# EAGLE design BLDC_Motor_Controller_2016_Rev1 (EAGLE 7.3.0)
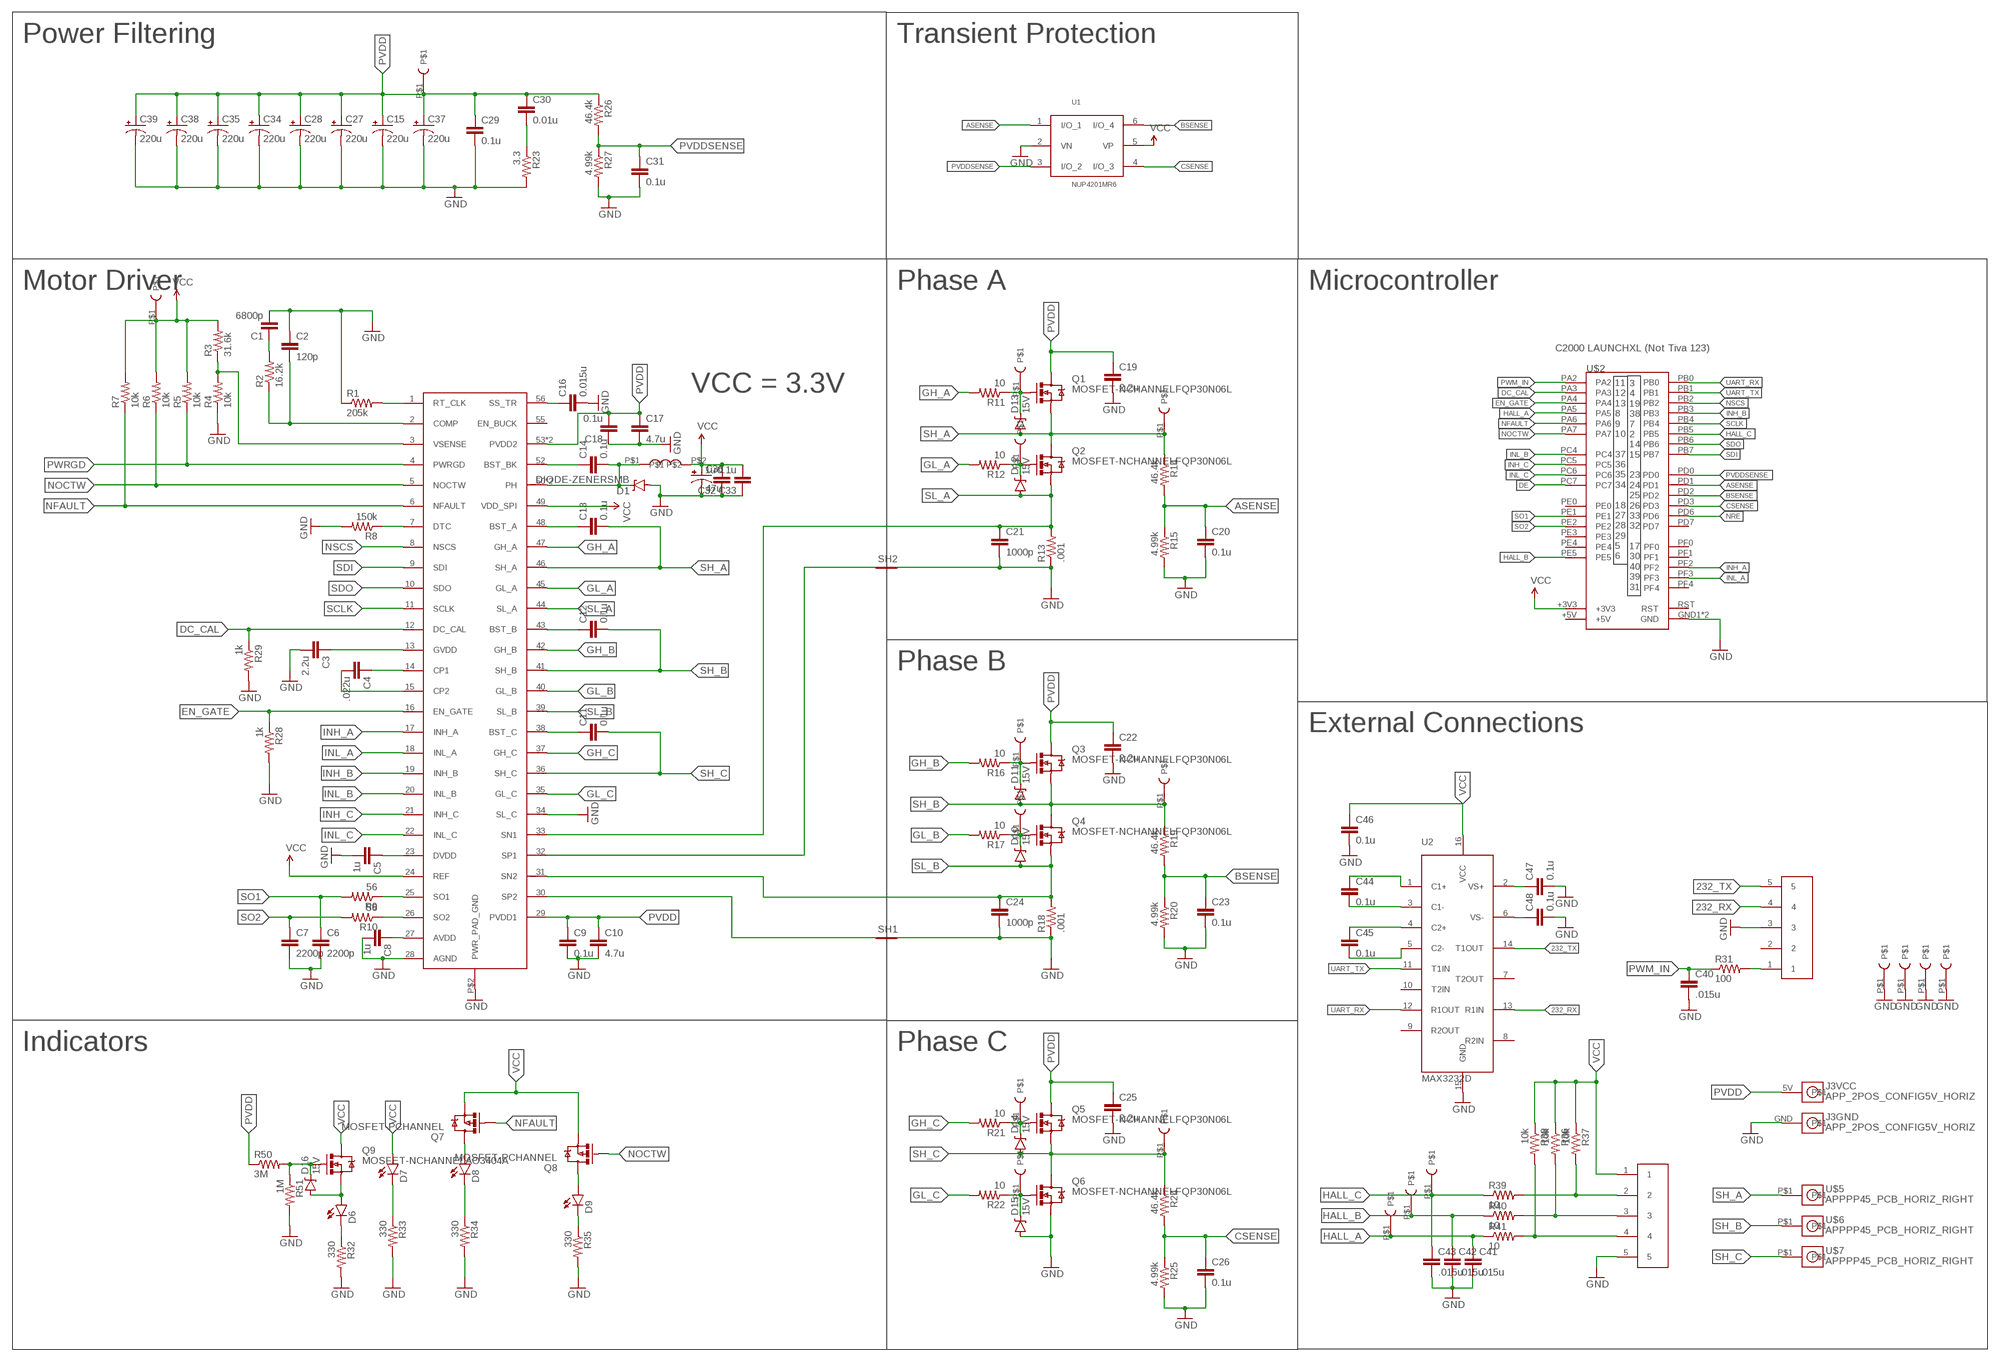
[diagram p0: schematic, sheet 1]

## Parts
C1  6800p  CAP0805  [0805]
C2  120p  CAP0805  [0805]
C3  2.2u  CAP1206  [1206]
C4  .022u  CAP0805  [0805]
C5  1u  CAP0805  [0805]
C6  2200p  CAP0805  [0805]
C7  2200p  CAP0805  [0805]
C8  1u  CAP0805  [0805]
C9  0.1u  CAP0805  [0805]
C10  4.7u  CAP1206  [1206]
C11  0.1u  CAP0805  [0805]
C12  0.1u  CAP0805  [0805]
C13  0.1u  CAP0805  [0805]
C14  0.1u  CAP0805  [0805]
C15  220u  CAP_POLPTH4  [CPOL-RADIAL-1000UF-25V]
C16  0.015u  CAP0805  [0805]
C17  4.7u  CAP1206  [1206]
C18  0.1u  CAP0805  [0805]
C19  2.2u  CAP1206  [1206]
C20  0.1u  CAP0805  [0805]
C21  1000p  CAP0805  [0805]
C22  2.2u  CAP1206  [1206]
C23  0.1u  CAP0805  [0805]
C24  1000p  CAP0805  [0805]
C25  2.2u  CAP1206  [1206]
C26  0.1u  CAP0805  [0805]
C27  220u  CAP_POLPTH4  [CPOL-RADIAL-1000UF-25V]
C28  220u  CAP_POLPTH4  [CPOL-RADIAL-1000UF-25V]
C29  0.1u  CAP0805  [0805]
C30  0.01u  CAP0805  [0805]
C31  0.1u  CAP0805  [0805]
C32  1u  CAP0805  [0805]
C33  0.1u  CAP0805  [0805]
C34  220u  CAP_POLPTH4  [CPOL-RADIAL-1000UF-25V]
C35  220u  CAP_POLPTH4  [CPOL-RADIAL-1000UF-25V]
C36  47u  CAP_POLPTH1  [CPOL-RADIAL-100UF-25V]
C37  220u  CAP_POLPTH4  [CPOL-RADIAL-1000UF-25V]
C38  220u  CAP_POLPTH4  [CPOL-RADIAL-1000UF-25V]
C39  220u  CAP_POLPTH4  [CPOL-RADIAL-1000UF-25V]
C40  .015u  CAP0805  [0805]
C41  .015u  CAP0805  [0805]
C42  .015u  CAP0805  [0805]
C43  .015u  CAP0805  [0805]
C44  0.1u  CAP0805  [0805]
C45  0.1u  CAP0805  [0805]
C46  0.1u  CAP0805  [0805]
C47  0.1u  CAP0805  [0805]
C48  0.1u  CAP0805  [0805]
D1  DIODE-ZENERSMB  [SMB-DIODE]
D6  LED1206  [LED-1206]
D7  LED1206  [LED-1206]
D8  LED1206  [LED-1206]
D9  LED1206  [LED-1206]
D10  15V  DIODE-ZENER3.3V  [SOD-323]
D11  15V  DIODE-ZENER3.3V  [SOD-323]
D12  15V  DIODE-ZENER3.3V  [SOD-323]
D13  15V  DIODE-ZENER3.3V  [SOD-323]
D14  15V  DIODE-ZENER3.3V  [SOD-323]
D15  15V  DIODE-ZENER3.3V  [SOD-323]
D16  15V  DIODE-ZENER3.3V  [SOD-323]
J3  APP_2POS_CONFIG5V_HORIZ  [APP45_5V_HORIZ_CONFIG]
Q1  MOSFET-NCHANNELFQP30N06L  [TO220V]
Q2  MOSFET-NCHANNELFQP30N06L  [TO220V]
Q3  MOSFET-NCHANNELFQP30N06L  [TO220V]
Q4  MOSFET-NCHANNELFQP30N06L  [TO220V]
Q5  MOSFET-NCHANNELFQP30N06L  [TO220V]
Q6  MOSFET-NCHANNELFQP30N06L  [TO220V]
Q7  MOSFET-PCHANNEL  [SOT23-3]
Q8  MOSFET-PCHANNEL  [SOT23-3]
Q9  MOSFET-NCHANNELAO3404A  [SOT23-3]
R1  205k  RESISTOR0805-RES  [0805]
R2  16.2k  RESISTOR0805-RES  [0805]
R3  31.6k  RESISTOR0805-RES  [0805]
R4  10k  RESISTOR0805-RES  [0805]
R5  10k  RESISTOR0805-RES  [0805]
R6  10k  RESISTOR0805-RES  [0805]
R7  10k  RESISTOR0805-RES  [0805]
R8  150k  RESISTOR0805-RES  [0805]
R9  56  RESISTOR0805-RES  [0805]
R10  56  RESISTOR0805-RES  [0805]
R11  10  RESISTOR0805-RES  [0805]
R12  10  RESISTOR0805-RES  [0805]
R13  .001  RESISTOR1206  [1206]
R14  46.4k  RESISTOR0805-RES  [0805]
R15  4.99k  RESISTOR0805-RES  [0805]
R16  10  RESISTOR0805-RES  [0805]
R17  10  RESISTOR0805-RES  [0805]
R18  .001  RESISTOR1206  [1206]
R19  46.4k  RESISTOR0805-RES  [0805]
R20  4.99k  RESISTOR0805-RES  [0805]
R21  10  RESISTOR0805-RES  [0805]
R22  10  RESISTOR0805-RES  [0805]
R23  3.3  RESISTOR0805-RES  [0805]
R24  46.4k  RESISTOR0805-RES  [0805]
R25  4.99k  RESISTOR0805-RES  [0805]
R26  46.4k  RESISTOR0805-RES  [0805]
R27  4.99k  RESISTOR0805-RES  [0805]
R28  1k  RESISTOR0805-RES  [0805]
R29  1k  RESISTOR0805-RES  [0805]
R31  100  RESISTOR0805-RES  [0805]
R32  330  RESISTOR0805-RES  [0805]
R33  330  RESISTOR0805-RES  [0805]
R34  330  RESISTOR0805-RES  [0805]
R35  330  RESISTOR0805-RES  [0805]
R36  10k  RESISTOR0805-RES  [0805]
R37  10k  RESISTOR0805-RES  [0805]
R38  10k  RESISTOR0805-RES  [0805]
R39  10  RESISTOR0805-RES  [0805]
R40  10  RESISTOR0805-RES  [0805]
R41  10  RESISTOR0805-RES  [0805]
R50  3M  RESISTOR0805-RES  [0805]
R51  1M  RESISTOR0805-RES  [0805]
SH1  SHORT-HT5  [SHORT_TOP-50]
SH2  SHORT-HT5  [SHORT_TOP-50]
U1  NUP4201MR6  [TSOP-6]
U2  MAX3232D  [SOIC16]
U$1  DRV8301  [DCA]
U$2  TIVA-C  [TIVA-C]
U$4  5PIN  [5PIN]
U$5  APPPP45_PCB_HORIZ_RIGHT  [APP45_PCB_HORIZ_RIGHT]
U$6  APPPP45_PCB_HORIZ_RIGHT  [APP45_PCB_HORIZ_RIGHT]
U$7  APPPP45_PCB_HORIZ_RIGHT  [APP45_PCB_HORIZ_RIGHT]
U$8  5PIN  [5PIN]
U$10  TEST_POINT_0.1INDIAM  [TEST_POINT_0.1INDIAM]
U$11  TEST_POINT_0.1INDIAM  [TEST_POINT_0.1INDIAM]
U$12  TEST_POINT_0.1INDIAM  [TEST_POINT_0.1INDIAM]
U$14  33u  INDUCTOR_DR74  [INDUCTOR_DR74]
U$15  TEST_POINT_0.1INDIAM  [TEST_POINT_0.1INDIAM]
U$16  TEST_POINT_0.1INDIAM  [TEST_POINT_0.1INDIAM]
U$17  TEST_POINT_0.1INDIAM  [TEST_POINT_0.1INDIAM]
U$18  TEST_POINT_0.1INDIAM  [TEST_POINT_0.1INDIAM]
U$19  TEST_POINT_0.1INDIAM  [TEST_POINT_0.1INDIAM]
U$20  TEST_POINT_0.1INDIAM  [TEST_POINT_0.1INDIAM]
U$21  TEST_POINT_0.1INDIAM  [TEST_POINT_0.1INDIAM]
U$22  TEST_POINT_0.1INDIAM  [TEST_POINT_0.1INDIAM]
U$23  TEST_POINT_0.1INDIAM  [TEST_POINT_0.1INDIAM]
U$24  TEST_POINT_0.1INDIAM  [TEST_POINT_0.1INDIAM]
U$25  TEST_POINT_0.1INDIAM  [TEST_POINT_0.1INDIAM]
U$26  TEST_POINT_0.1INDIAM  [TEST_POINT_0.1INDIAM]
U$27  TEST_POINT_0.1INDIAM  [TEST_POINT_0.1INDIAM]
U$28  TEST_POINT_0.1INDIAM  [TEST_POINT_0.1INDIAM]
U$29  TEST_POINT_0.1INDIAM  [TEST_POINT_0.1INDIAM]

## Nets
232_RX: U2.13(R1IN) U$4.4
232_TX: U2.14(T1OUT) U$4.5
ASENSE: C20.1 R14.2 R15.1 U1.1(I/O_1) U$2.PD1
BSENSE: C23.1 R19.2 R20.1 U1.6(I/O_4) U$2.PD2
CSENSE: C26.1 R24.2 R25.1 U1.4(I/O_3) U$2.PD3
DC_CAL: R29.1 U$1.12(DC_CAL) U$2.PA3
DE: U$2.PC7
EN_GATE: R28.1 U$1.16(EN_GATE) U$2.PA4
GH_A: R11.2 U$1.47(GH_A)
GH_B: R16.2 U$1.42(GH_B)
GH_C: R21.2 U$1.37(GH_C)
GL_A: R12.2 U$1.45(GL_A)
GL_B: R17.2 U$1.40(GL_B)
GL_C: R22.2 U$1.35(GL_C)
GND: C1.2 C2.1 C3.2 C5.2 C6.2 C7.2 C8.2 C9.2 C10.2 C15.2(-) C16.2 C17.2 C18.1 C19.2 C20.2 C21.2 C22.2 C23.2 C24.2 C25.2 C26.2 C27.2(-) C28.2(-) C29.2 C31.2 C32.1 C33.1 C34.2(-) C35.2(-) C36.2(-) C37.2(-) C38.2(-) C39.2(-) C40.2 C41.2 C42.2 C43.2 C46.2 C47.2 C48.2 D1.A D15.A J3.GND Q6.3(S) R1.1 R4.1 R8.2 R13.1 R15.2 R18.1 R20.2 R23.2 R25.2 R27.2 R28.2 R29.2 R32.2 R33.2 R34.2 R35.2 R51.2 SH1.2 SH2.2 U1.2(VN) U2.15(GND) U$1.28(AGND) U$1.34(SL_C) U$1.P$2(PWR_PAD_GND) U$2.GND1(GND) U$2.GND2(GND) U$4.3 U$8.5 U$26.P$1 U$27.P$1 U$28.P$1 U$29.P$1
HALL_A: C41.1 R41.1 U$2.PA5 U$22.P$1
HALL_B: C42.1 R40.1 U$2.PE5 U$21.P$1
HALL_C: C43.1 R39.1 U$2.PB5 U$23.P$1
INH_A: U$1.17(INH_A) U$2.PF2
INH_B: U$1.19(INH_B) U$2.PB3
INH_C: U$1.21(INH_C) U$2.PC5
INL_A: U$1.18(INL_A) U$2.PF3
INL_B: U$1.20(INL_B) U$2.PC4
INL_C: U$1.22(INL_C) U$2.PC6
N$1: C2.2 R2.1 U$1.2(COMP)
N$2: C1.1 R2.2
N$3: R3.1 R4.2 U$1.3(VSENSE)
N$4: R1.2 U$1.1(RT_CLK)
N$5: R8.1 U$1.7(DTC)
N$6: C4.1 U$1.14(CP1)
N$7: C4.2 U$1.15(CP2)
N$8: C3.1 U$1.13(GVDD)
N$9: C5.1 U$1.23(DVDD)
N$10: R9.1 U$1.25(SO1)
N$11: R10.1 U$1.26(SO2)
N$12: C8.1 U$1.27(AVDD)
N$13: D13.C Q1.1(G) R11.1 U$12.P$1
N$14: D11.C Q3.1(G) R16.1 U$16.P$1
N$15: D10.C Q4.1(G) R17.1 U$17.P$1
N$16: D12.C Q2.1(G) R12.1 U$15.P$1
N$17: D14.C Q5.1(G) R21.1 U$18.P$1
N$18: D15.C Q6.1(G) R22.1 U$19.P$1
N$20: R37.2 R39.2 U$8.2
N$21: C11.1 U$1.38(BST_C)
N$22: C30.2 R23.1
N$23: D6.C R32.1
N$24: D7.C R33.1
N$25: C12.1 U$1.43(BST_B)
N$26: D8.C R34.1
N$27: D9.C R35.1
N$28: D9.A Q8.3(D)
N$29: C13.1 U$1.48(BST_A)
N$30: C14.1 U$1.52(BST_BK)
N$31: C14.2 D1.C U$1.50(PH) U$1.51(PH) U$14.P$1
N$32: D8.A Q7.3(D)
N$33: R36.2 R40.2 U$8.3
N$34: R31.2 U$4.1
N$35: C16.1 U$1.56(SS_TR)
N$38: D16.C Q9.1(G) R50.2 R51.1
N$39: R38.2 R41.2 U$8.4
N$40: C44.1 U2.1(C1+)
N$41: D6.A D16.A Q9.2(S)
N$42: C44.2 U2.3(C1-)
N$43: C45.1 U2.4(C2+)
N$44: C45.2 U2.5(C2-)
N$45: C48.1 U2.6(VS-)
N$46: C47.1 U2.2(VS+)
NFAULT: Q7.1(G) R7.1 U$1.6(NFAULT) U$2.PA6
NOCTW: Q8.1(G) R6.1 U$1.5(NOCTW) U$2.PA7
NRE: U$2.PD6
NSCS: U$1.8(NSCS) U$2.PB2
PVDD: C9.1 C10.1 C15.1(+) C17.1 C18.2 C19.1 C22.1 C25.1 C27.1(+) C28.1(+) C29.1 C30.1 C34.1(+) C35.1(+) C37.1(+) C38.1(+) C39.1(+) J3.5V Q1.2(D) Q3.2(D) Q5.2(D) R26.1 R50.1 U$1.29(PVDD1) U$1.53(PVDD2) U$1.54(PVDD2) U$11.P$1
PVDDSENSE: C31.1 R26.2 R27.1 U1.3(I/O_2) U$2.PD0
PWM_IN: C40.1 R31.1 U$2.PA2
PWRGD: R5.1 U$1.4(PWRGD)
SCLK: U$1.11(SCLK) U$2.PB4
SDI: U$1.9(SDI) U$2.PB7
SDO: U$1.10(SDO) U$2.PB6
SH_A: C13.2 D13.A Q1.3(S) Q2.2(D) R14.1 U$1.46(SH_A) U$5.P$1 U$25.P$1
SH_B: C12.2 D11.A Q3.3(S) Q4.2(D) R19.1 U$1.41(SH_B) U$6.P$1 U$24.P$1
SH_C: C11.2 D14.A Q5.3(S) Q6.2(D) R24.1 U$1.36(SH_C) U$7.P$1 U$20.P$1
SL_A: C21.1 D12.A Q2.3(S) R13.2 U$1.33(SN1) U$1.44(SL_A)
SL_B: C24.1 D10.A Q4.3(S) R18.2 U$1.31(SN2) U$1.39(SL_B)
SO1: C6.1 R9.2 U$2.PE1
SO2: C7.1 R10.2 U$2.PE2
SP1: SH2.1 U$1.32(SP1)
SP2: SH1.1 U$1.30(SP2)
UART_RX: U2.12(R1OUT) U$2.PB0
UART_TX: U2.11(T1IN) U$2.PB1
VCC: C32.2 C33.2 C36.1(+) C46.1 D7.A Q7.2(S) Q8.2(S) Q9.3(D) R3.2 R5.2 R6.2 R7.2 R36.1 R37.1 R38.1 U1.5(VP) U2.16(VCC) U$1.24(REF) U$1.49(VDD_SPI) U$2.+3V3 U$8.1 U$10.P$1 U$14.P$2
Unconnected: U2.7(T2OUT) U2.8(R2IN) U2.9(R2OUT) U2.10(T2IN) U$1.55(EN_BUCK) U$2.PD7 U$2.PE0 U$2.PE3 U$2.PE4 U$2.PF0 U$2.PF1 U$2.PF4 U$4.2

## Notes on the sheet
- Power Filtering | Transient Protection
- Motor Driver | Phase A | Microcontroller
- C2000 LAUNCHXL (Not Tiva 123)
- VCC = 3.3V
- 11
  12
  13
  8
  9
  10
  
  37
  36
  35
  34
  
  18
  27
  28
  29
  5
  6
- 3
  4
  19
  38
  7
  2
  14
  15
  
  23
  24
  25
  26
  33
  32
  
  17
  30
  40
  39
  31
- Phase B
- External Connections
- Indicators | Phase C

## Power pins joined to a net without a drawn wire
+5V: U$2.+5V
RST: U$2.RST

## Library data of the parts
C1-C14 C16-C26 C29-C33 C40-C48 = SparkFun-Passives:CAP: Capacitor Standard 0603 ceramic capacitor, and 0.1" leaded capacitor.
C15 C27 C28 C34-C39 = SparkFun-Passives:CAP_POL: Capacitor Polarized These are standard SMD and PTH capacitors. Normally 10uF, 47uF, and 100uF in electrolytic and tantalum varieties. Always verify the external diameter of the through hole cap, it varies with capacity, voltage, and manufacturer. The EIA devices should be standard.
D1 = SparkFun-DiscreteSemi:DIODE-ZENER: Zener Diode Production Part - 8199 3.4V Zener Voltage
D6-D9 = SparkFun-LED:LED: LEDs Standard schematic elements and footprints for 5mm, 3mm, 1206, and 0603 sized LEDs. 5mm - Spark Fun Electronics SKU : COM-00529 (and others)
D10-D16 = SparkFun-DiscreteSemi:DIODE-ZENER: Zener Diode Production Part - 8199 3.4V Zener Voltage; PROD_ID: DIO-11284; VALUE: 3.3V
J3 = MRDT-Connectors:APP_2POS_CONFIG; COLOR1: RED; COLOR2: BLACK
Q1-Q6 = SparkFun-DiscreteSemi:MOSFET-NCHANNEL: Common NMOSFET Parts MFG P/N Store ID Prod ID FDD8780 TRANS-09984 SI7820DN TRANS-11055 FDS6630A IC-08089 2N7002PW TRANS-11151 FQP30N06L COM-10213 TRANS-10060 BSS123LT1G TRANS-08345 BSS138 TRANS-00830 BS170 2N7000; PROD_ID: TRANS-10060
Q7 Q8 = SparkFun-DiscreteSemi:MOSFET-PCHANNEL: Generic PMOSFET IRLML2244 - TRANS-11153 (SOT-23 -20V -4.3A) (1.Gate 2.Source 3.Drain) FQP27P06 - COM-10349 <http://www.sparkfun.com/products/10349> (TO-220 -60V -27A) (1.Gate 2.Source 3.Drain); PROD_ID: TRANS-08285
Q9 = SparkFun-DiscreteSemi:MOSFET-NCHANNEL: Common NMOSFET Parts MFG P/N Store ID Prod ID FDD8780 TRANS-09984 SI7820DN TRANS-11055 FDS6630A IC-08089 2N7002PW TRANS-11151 FQP30N06L COM-10213 TRANS-10060 BSS123LT1G TRANS-08345 BSS138 TRANS-00830 BS170 2N7000; PROD_ID: TRAN-12988
R1-R29 R31-R41 R50 R51 = SparkFun-Passives:RESISTOR: Resistor Basic schematic elements and footprints for 0603, 1206, and PTH resistors.
SH1 SH2 = BLDC_Motor_Controller_2016_Rev1:SHORT-H: Short between two nets; BOM: no
U1 = MRDT-ICs:NUP4201MR6
U2 = MRDT-ICs:MAX*232; OPERATING_VOLTAGE: 3V3
U$1 = DRV8301:DRV8301
U$2 = MRDT-2015-General:TIVA-C: TIVA-C DEV BOARD (NON-CONNECTED)
U$4 U$8 = Molex-SL:5PIN
U$5-U$7 = MRDT-Connectors:APP: http://www.powerwerx.com/anderson-powerpoles/
U$10-U$12 U$15-U$29 = MRDT-Connectors:TEST_POINT_0.1INDIAM
U$14 = Inductor_DR74:INDUCTOR_DR74

## Board
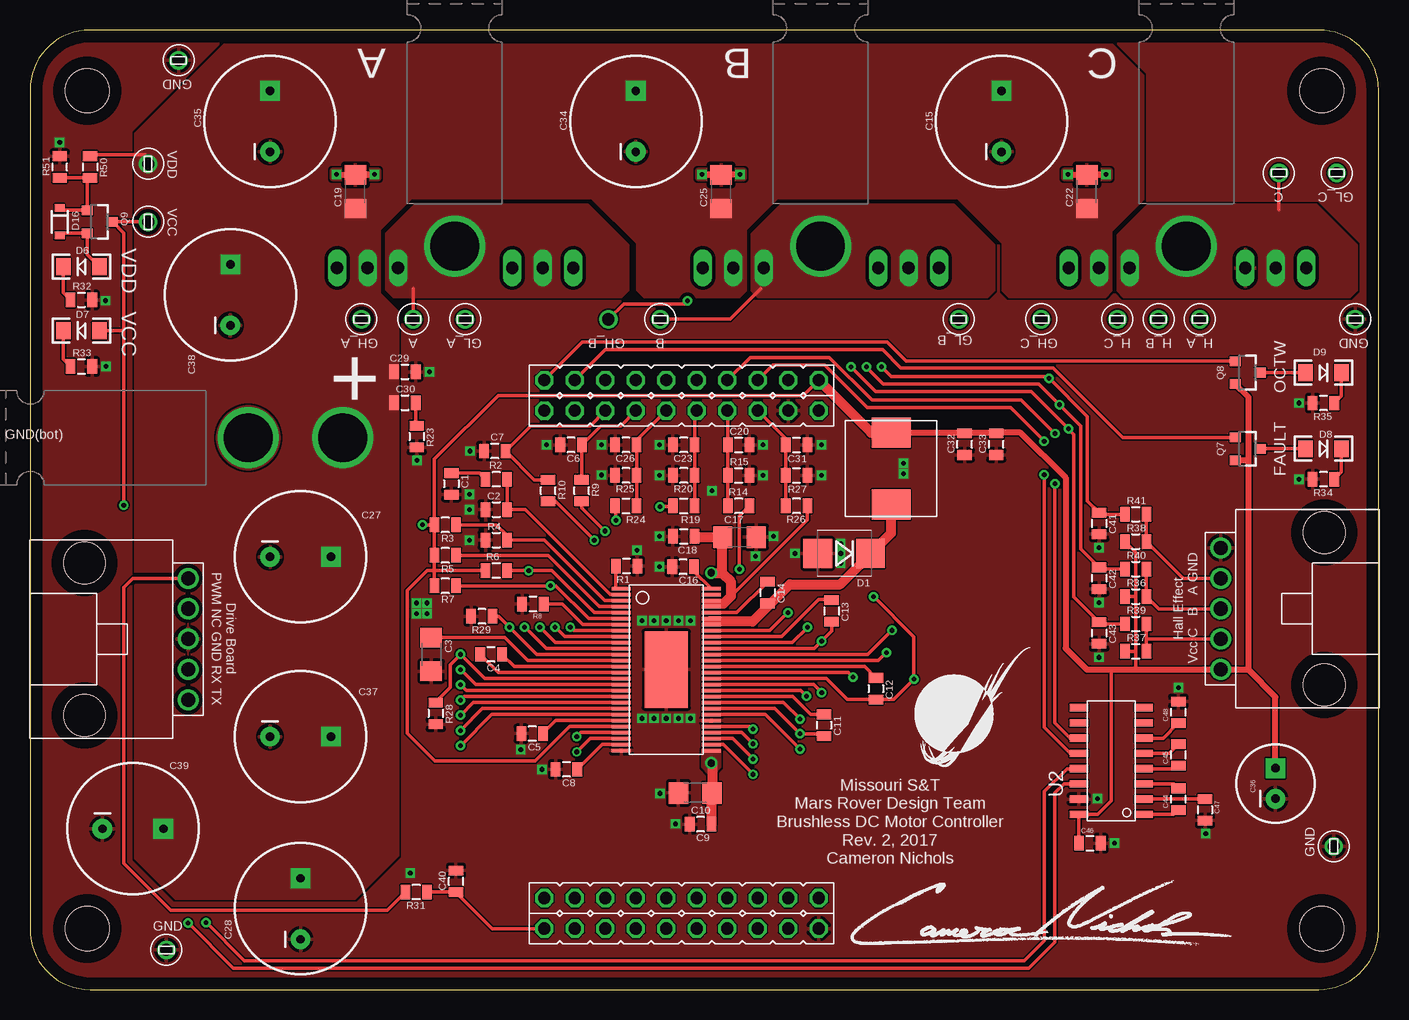
[diagram p1: board, top side]
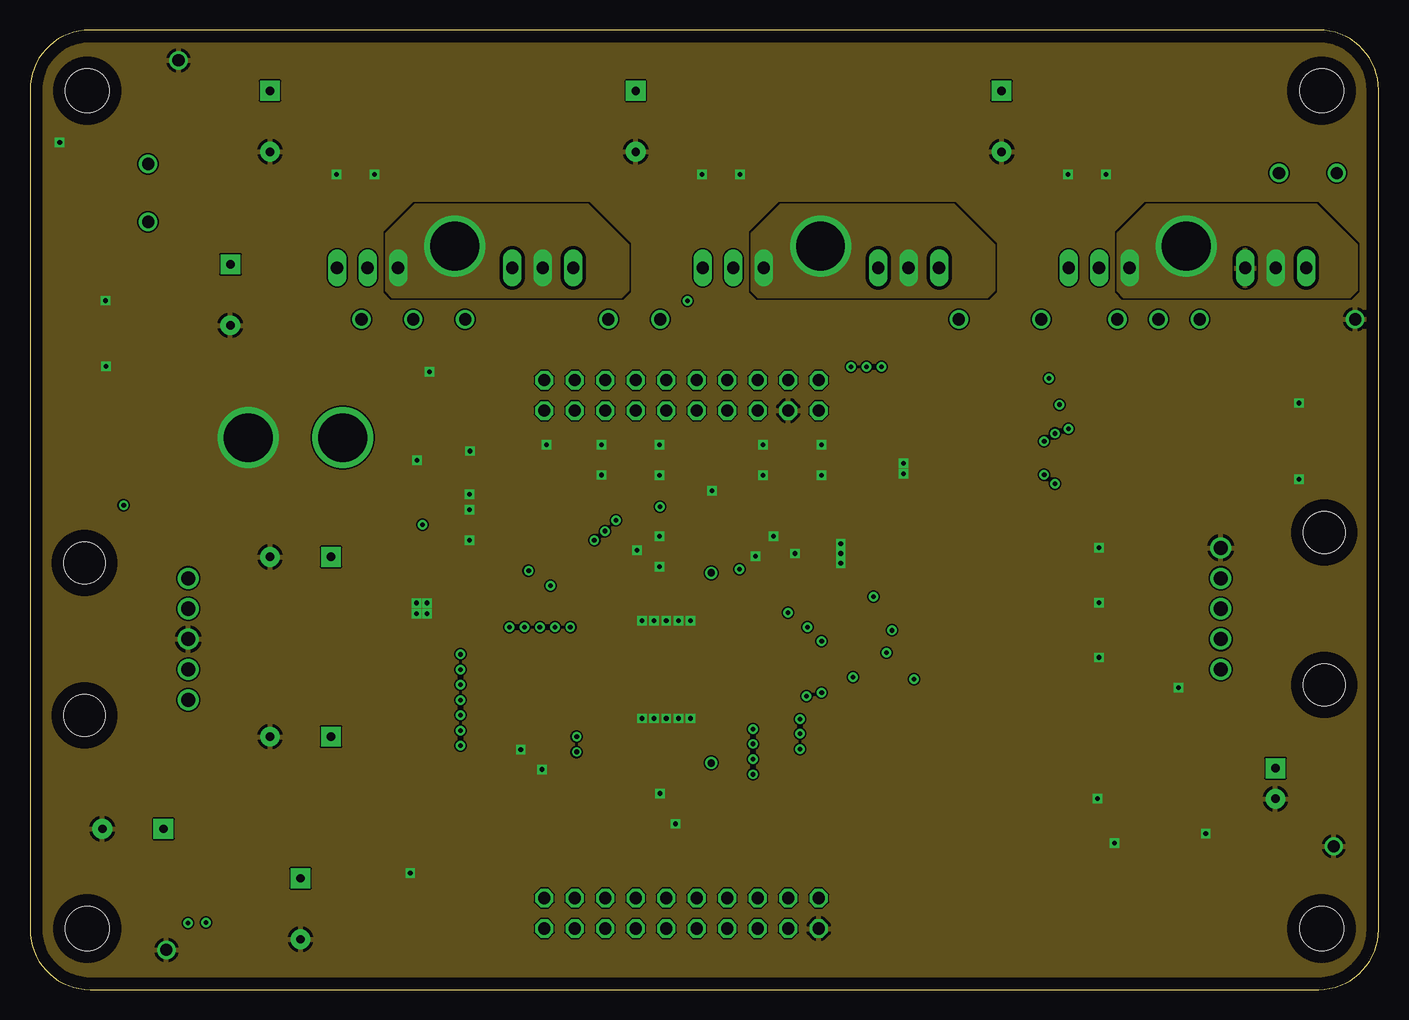
[diagram p2: board, inner layer UpperMid]
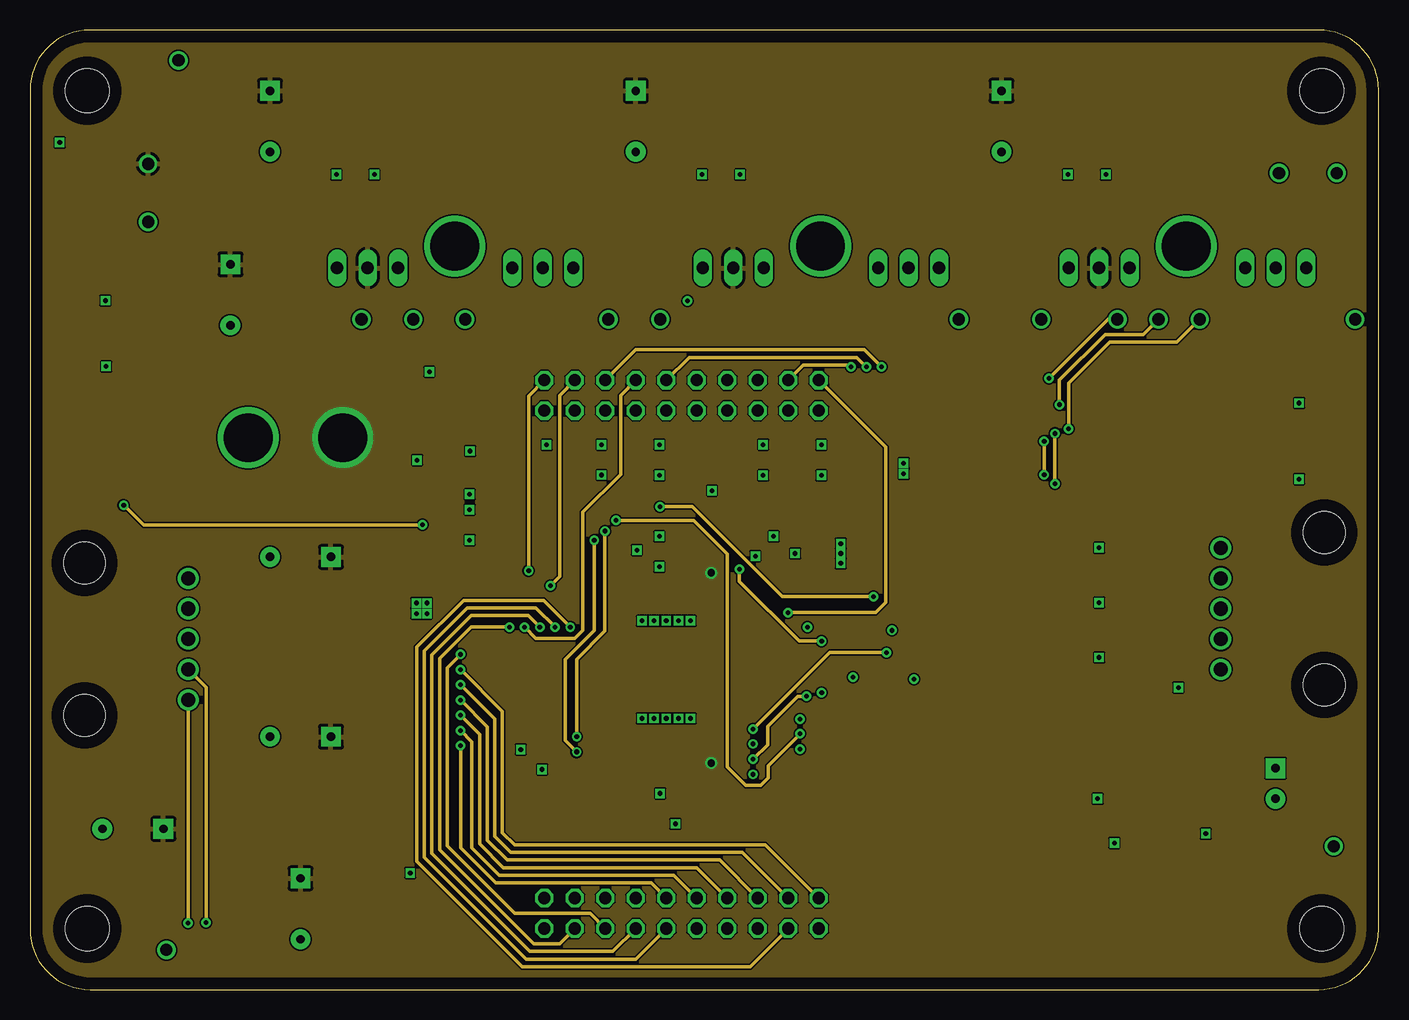
[diagram p3: board, inner layer LowerMid]
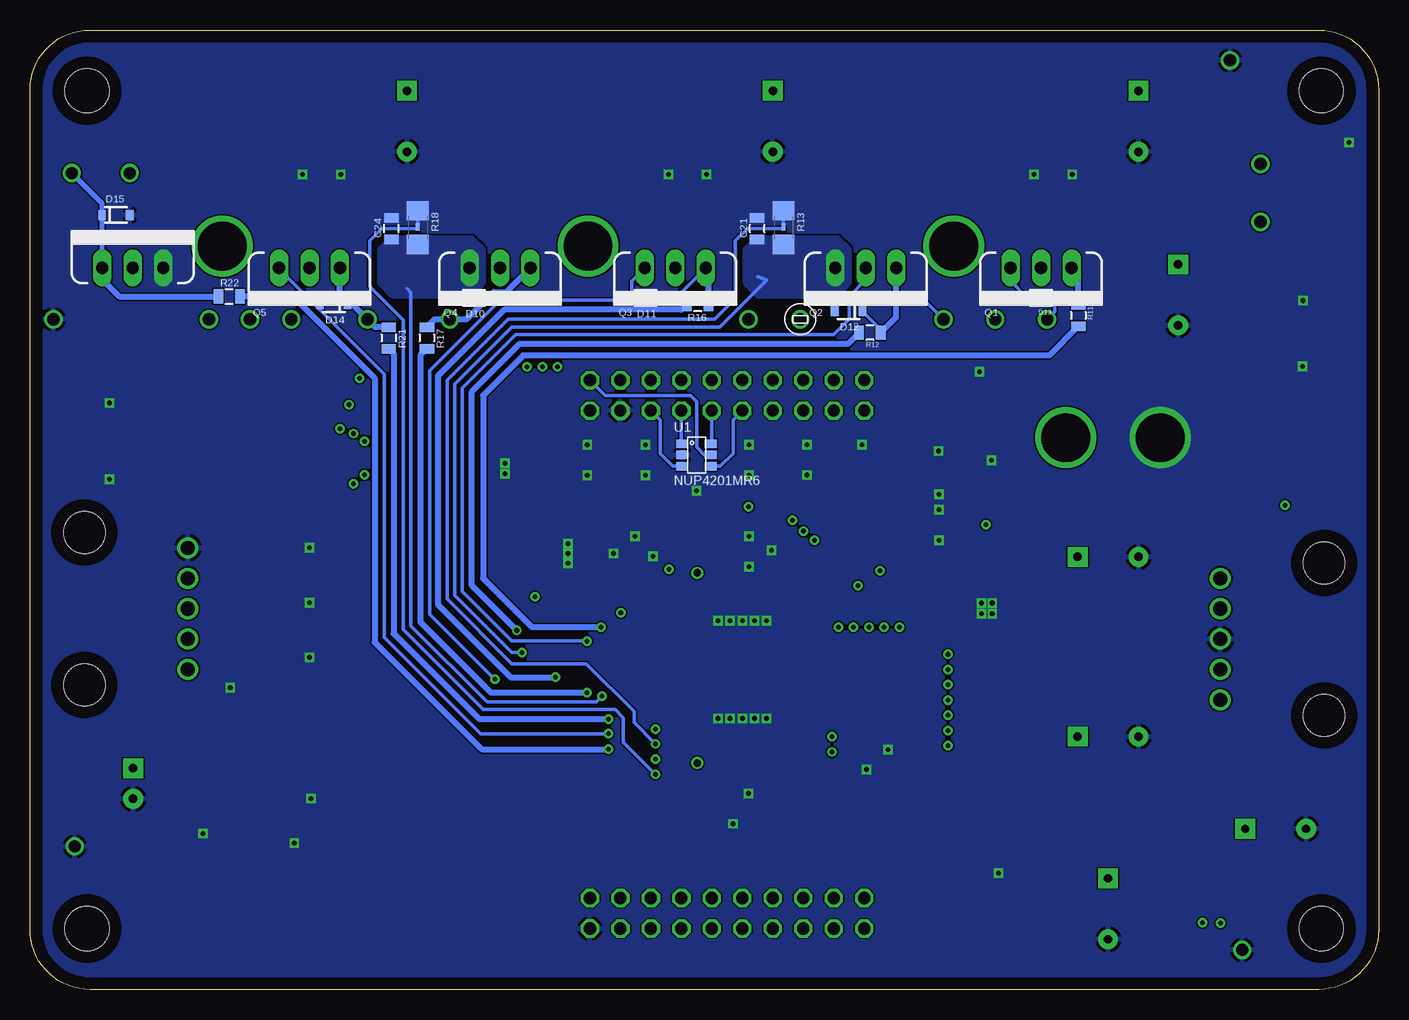
[diagram p4: board, bottom side, seen from below]

Size 112.38 x 80 mm. Coordinates in mm from the lower left corner, seen from the top.
Outline: 5,0 107.38,0 arc90 112.38,5 112.38,75 arc90 107.38,80 5,80 arc90 0,75 0,5 arc90 5,0
Copper layers (1*2*15*16): Top 0.035mm / dielectric 1.5mm / UpperMid 0.035mm / dielectric 0.15mm / LowerMid 0.035mm / dielectric 0.2mm / Bottom 0.035mm
Design rules "advanced_circuits_standard *": minimum track width 5mil, minimum drill 10mil, track to track 5mil, track to pad 5mil, pad to pad 5mil, via to via 5mil, smd to smd 5mil, copper to edge 40mil, drill to drill 5mil, minimum pad ring 10mil, minimum via ring 8mil, stop-mask expansion 4mil, vias tented up to drill 0mil, thermal gap 10mil
Holes 3.66 mm at 4.76,74.93 4.76,5.08 107.63,5.08 107.63,74.93

### Footprints (pad centres in the part's own frame; a part is rotated, then mirrored left to right if it is on the bottom)
0805 = smd 0.8 x 1.2: 1 -0.9,0; 2 0.9,0
1206 = smd 1.6 x 1.8: 1 -1.4,0; 2 1.4,0
CPOL-RADIAL-1000UF-25V = drill 0.7 pad 1.651 square: 1 2.54,0 | drill 0.7 pad 1.651: 2 -2.54,0
CPOL-RADIAL-100UF-25V = drill 0.7 pad 1.651 square: 1 1.27,0 | drill 0.7 pad 1.651: 2 -1.27,0
SMB-DIODE = smd 2.4 x 2.4: A 2.2,0; C -2.2,0
LED-1206 = smd 1.2 x 1.4: A -1.5,0; C 1.5,0
SOD-323 = smd 0.63 x 0.83: A 1.15,0; C -1.15,0
APP45_5V_HORIZ_CONFIG = drill 4.064: 5V 36.068,3.937; GND 28.194,3.937
TO220V = drill 1.016 long: 1 -2.54,0; 2 0,0; 3 2.54,0
SOT23-3 = smd 0.8 x 0.9: 1 -0.95,-1; 2 0.95,-1; 3 0,1.1
SHORT_TOP-50 = smd 0.305 x 0.305: 1 0.152,0; 2 -0.152,0
TSOP-6 = smd 0.991 x 0.711: 1 -1.194,0.94; 2 -1.194,0; 3 -1.194,-0.94; 4 1.194,-0.94; 5 1.194,0; 6 1.194,0.94
SOIC16 = smd 0.6 x 1.55: 1 -4.445,-2.7; 2 -3.175,-2.7; 3 -1.905,-2.7; 4 -0.635,-2.7; 5 0.635,-2.7; 6 1.905,-2.7; 7 3.175,-2.7; 8 4.445,-2.7; 9 4.445,2.7; 10 3.175,2.7; 11 1.905,2.7; 12 0.635,2.7; 13 -0.635,2.7; 14 -1.905,2.7; 15 -3.175,2.7; 16 -4.445,2.7
DCA = smd 0.3 x 1.55: 1 -6.75,-3.75; 2 -6.25,-3.75; 3 -5.75,-3.75; 4 -5.25,-3.75; 5 -4.75,-3.75; 6 -4.25,-3.75; 7 -3.75,-3.75; 8 -3.25,-3.75; 9 -2.75,-3.75; 10 -2.25,-3.75; 11 -1.75,-3.75; 12 -1.25,-3.75; 13 -0.75,-3.75; 14 -0.25,-3.75; 15 0.25,-3.75; 16 0.75,-3.75; 17 1.25,-3.75; 18 1.75,-3.75; 19 2.25,-3.75; 20 2.75,-3.75; 21 3.25,-3.75; 22 3.75,-3.75; 23 4.25,-3.75; 24 4.75,-3.75; 25 5.25,-3.75; 26 5.75,-3.75; 27 6.25,-3.75; 28 6.75,-3.75; 29 6.75,3.75; 30 6.25,3.75; 31 5.75,3.75; 32 5.25,3.75; 33 4.75,3.75; 34 4.25,3.75; 35 3.75,3.75; 36 3.25,3.75; 37 2.75,3.75; 38 2.25,3.75; 39 1.75,3.75; 40 1.25,3.75; 41 0.75,3.75; 42 0.25,3.75; 43 -0.25,3.75; 44 -0.75,3.75; 45 -1.25,3.75; 46 -1.75,3.75; 47 -2.25,3.75; 48 -2.75,3.75; 49 -3.25,3.75; 50 -3.75,3.75; 51 -4.25,3.75; 52 -4.75,3.75; 53 -5.25,3.75; 54 -5.75,3.75; 55 -6.25,3.75; 56 -6.75,3.75 | smd 6.35 x 3.61: P$2 0,0
TIVA-C = drill 1.016 octagon: +3V3 30.48,2.54; +5V 30.48,5.08; GND1 33.02,5.08; GND2 30.48,48.26; PA2 53.34,48.26; PA3 50.8,48.26; PA4 48.26,48.26; PA5 48.26,2.54; PA6 50.8,2.54; PA7 53.34,2.54; PB0 35.56,2.54; PB1 38.1,2.54; PB2 33.02,48.26; PB3 35.56,45.72; PB4 45.72,2.54; PB5 33.02,2.54; PB6 45.72,48.26; PB7 43.18,48.26; PC4 38.1,45.72; PC5 40.64,45.72; PC6 43.18,45.72; PC7 45.72,45.72; PD0 35.56,5.08; PD1 38.1,5.08; PD2 40.64,5.08; PD3 43.18,5.08; PD6 48.26,45.72; PD7 50.8,45.72; PE0 35.56,48.26; PE1 45.72,5.08; PE2 48.26,5.08; PE3 50.8,5.08; PE4 40.64,2.54; PE5 43.18,2.54; PF0 38.1,48.26; PF1 53.34,5.08; PF2 30.48,45.72; PF3 33.02,45.72; PF4 53.34,45.72; RST 40.64,48.26
5PIN = drill 1.168: 1 5.08,0; 2 2.54,0; 3 0,0; 4 -2.54,0; 5 -5.08,0 | hole 3.454: -6.35,8.636; 6.35,8.636
APP45_PCB_HORIZ_RIGHT = drill 4.064: P$1 28.194,3.969
TEST_POINT_0.1INDIAM = drill 1.016: P$1 0,0
INDUCTOR_DR74 = smd 2.5 x 3.25: P$1 -3,0; P$2 3,0

### Placement (x,y rotation side)
C1  35.12,42.16 270 top
C2  38.86,40.01 0 top
C3  33.43,27.94 270 top
C4  38.42,27.94 180 top
C5  41.85,21.34 180 top
C6  45.08,45.4 180 top
C7  38.73,44.89 180 top
C8  44.7,18.35 180 top
C9  55.88,13.78 180 top
C10  55.44,16.38 180 top
C11  66.17,22.03 270 top
C12  70.48,25.08 270 top
C13  66.8,31.56 270 top
C14  61.47,33.08 270 top
C15  80.96,72.39 90 top
C16  54.42,35.24 180 top
C17  59.12,37.72 0 top
C18  54.48,37.78 0 top
C19  27.11,66.52 90 top
C20  59.06,45.4 0 top
C21  51.78,63.44 90 bottom
C22  88.07,66.52 90 top
C23  54.48,45.4 180 top
C24  82.26,63.44 90 bottom
C25  57.59,66.52 90 top
C26  49.66,45.4 180 top
C27  22.54,36.07 0 top
C28  22.54,6.73 90 top
C29  31.24,51.5 0 top
C30  31.24,48.93 0 top
C31  63.88,45.4 0 top
C32  77.88,45.47 90 top
C33  80.52,45.47 90 top
C34  50.48,72.39 90 top
C35  20,72.39 90 top
C36  103.79,17.18 90 top
C37  22.54,21.08 0 top
C38  16.7,57.91 90 top
C39  8.57,13.4 0 top
C40  35.5,9.02 90 top
C41  89.09,38.86 270 top
C42  89.09,34.29 270 top
C43  89.09,29.72 270 top
C44  95.69,15.88 90 top
C45  95.69,19.56 90 top
C46  88.33,12.19 0 top
C47  97.92,14.99 270 top
C48  95.69,23.11 90 top
D1  67.85,36.35 180 top
D6  4.29,60.26 180 top
D7  4.29,54.93 180 top
D8  107.79,45.09 0 top
D9  107.79,51.44 0 top
D10  75.37,57.66 180 bottom
D11  61.09,57.66 180 bottom
D12  44.17,56.56 180 bottom
D13  28.13,57.66 180 bottom
D14  87.06,57.15 180 bottom
D15  105.22,64.58 0 bottom
D16  2.48,64.01 270 top
J3  -10,42.07 0 top
Q1  28.13,60.17 180 bottom
Q2  42.74,60.17 180 bottom
Q3  58.61,60.17 180 bottom
Q4  73.22,60.17 180 bottom
Q5  89.09,60.17 180 bottom
Q6  103.82,60.17 0 bottom
Q7  101.44,45.09 270 top
Q8  101.44,51.44 270 top
Q9  5.78,64.01 270 top
R1  49.72,35.31 180 top
R2  38.86,42.55 180 top
R3  34.61,38.74 180 top
R4  38.86,37.47 0 top
R5  34.61,36.2 180 top
R6  38.86,34.93 180 top
R7  34.61,33.66 180 top
R8  41.91,32.13 180 top
R9  45.97,41.59 90 top
R10  43.18,41.59 90 top
R11  25.02,56.2 270 bottom
R12  42.39,54.77 180 bottom
R13  49.59,63.53 270 bottom
R14  59.06,40.32 180 top
R15  59.06,42.86 0 top
R16  56.74,57.15 180 bottom
R17  79.31,54.32 270 bottom
R18  80.07,63.53 270 bottom
R19  54.48,40.32 0 top
R20  54.48,42.86 180 top
R21  82.49,54.32 270 bottom
R22  95.79,57.79 0 bottom
R23  32.23,46.1 270 top
R24  49.66,40.32 0 top
R25  49.66,42.86 180 top
R26  63.88,40.32 180 top
R27  63.88,42.86 0 top
R28  33.81,23.02 270 top
R29  37.66,31.11 180 top
R31  32.19,8.13 180 top
R32  4.29,57.5 0 top
R33  4.29,51.94 0 top
R34  107.79,42.55 180 top
R35  107.79,48.9 180 top
R36  92.14,32.77 0 top
R37  92.14,28.19 0 top
R38  92.14,37.34 0 top
R39  92.14,30.48 0 top
R40  92.14,35.05 0 top
R41  92.14,39.62 0 top
R50  5.02,68.58 270 top
R51  2.48,68.58 90 top
SH1  80.07,63.6 270 bottom
SH2  49.59,63.6 270 bottom
U1  56.83,44.58 0 bottom
U2  90.11,19.05 90 top
U$1  53.02,26.67 270 top
U$2  96.2,53.34 180 top
U$4  13.18,29.21 90 top
U$5  31.43,90.17 270 top
U$6  61.91,90.17 270 top
U$7  92.39,90.17 270 top
U$8  99.22,31.75 270 top
U$9  [MRDT_LOGO]  73.7,17.7 0 top
U$10  9.84,64.01 90 top
U$11  9.84,68.83 90 top
U$12  27.62,55.88 0 top
U$14  71.75,43.43 90 top
U$15  36.26,55.88 0 top
U$16  48.2,55.88 0 bottom
U$17  77.41,55.88 0 top
U$18  84.26,55.88 0 top
U$19  108.9,68.07 0 top
U$20  104.08,68.07 0 top
U$21  94.04,55.88 0 top
U$22  90.61,55.88 0 top
U$23  97.47,55.88 0 top
U$24  52.51,55.88 0 top
U$25  31.94,55.88 0 top
U$26  108.65,11.94 90 top
U$27  12.38,77.47 180 top
U$28  11.37,3.3 180 top
U$29  110.43,55.88 180 top

### Tracks (layer width: path | path; a pad name or v marks a point on that pad's centre or on a via)
232_RX  (via drill 0.38)
  Top 0.305: U2.13 86.42,18.41 84.52,16.51 84.52,4.06 82.87,2.41 17.84,2.41 v14.67,5.59
  LowerMid 0.305: v14.67,5.59 14.67,25.18 U$4.4
232_TX  (via drill 0.38)
  Top 0.305: U2.14 86.17,17.14 85.41,16.38 85.41,3.94 83.25,1.78 16.95,1.78 v13.18,5.56
  LowerMid 0.305: v13.18,5.56 U$4.5
ASENSE
  Top 0.305: R14.2 R15.1 C20.1 58.15,48.21 U$2.PD1
  Bottom 0.305: U1.1 58.1,45.59 U$2.PD1
BSENSE
  Top 0.305: R19.2 R20.1 C23.1 55.38,48.08 U$2.PD2
  Bottom 0.305: U1.6 55.56,45.59 U$2.PD2
CSENSE
  Top 0.305: R24.2 R25.1 C26.1 50.56,45.8 U$2.PD3
  Bottom 0.305: U1.4 54.85,43.64 53.78,44.7 53.78,47.5 U$2.PD3
DC_CAL  (via drill 0.38)
  Top 0.305: U$1.12 42.25,27.92 v39.94,30.23 39.05,31.11 R29.1
  LowerMid 0.305: U$2.PA3 44.13,3.81 41.97,3.81 34.13,11.65 34.13,27.59 36.77,30.23 v39.94,30.23
EN_GATE  (via drill 0.38)
  Top 0.305: U$1.16 37.9,25.92 v35.88,27.94 35.02,27.08 35.02,25.18 33.81,23.97 R28.1
  LowerMid 0.305: U$2.PA4 46.67,6.35 40.39,6.35 34.77,11.97 34.77,26.83 v35.88,27.94
GH_A  (via drill 0.38)
  Top 0.305: 59.19,28.92 U$1.47 63.53,28.92 v64.8,30.19
  Bottom 0.508: R11.2 27.45,52.86 71.28,52.86 74.61,49.53 74.61,34.29 70.52,30.19 v64.8,30.19
GH_B  (via drill 0.38)
  Top 0.305: U$1.42 68.19,26.42 v68.58,26.04
  Bottom 0.508: v68.58,26.04 72.33,26.04 78.39,32.1 78.39,51.15 72.87,56.67 58.11,56.67 R16.2
GH_C  (via drill 0.38)
  Top 0.305: U$1.37 62.79,23.92 v64.17,22.54
  Bottom 0.508: R21.2 82.07,53.01 82.07,29.69 74.93,22.54 v64.17,22.54
GL_A  (via drill 0.38)
  Top 0.305: U$1.45 69.8,27.92 v71.82,29.94
  Bottom 0.508: v71.82,29.94 75.57,33.69 75.57,49.85 71.6,53.82 44.24,53.82 R12.2
GL_B  (via drill 0.38)
  Top 0.305: U$1.40 65.32,25.42 v65.98,24.77
  Bottom 0.508: v65.98,24.77 73.98,24.77 79.85,30.64 79.85,52.88 R17.2
GL_C  (via drill 0.38)
  Top 0.305: U$1.35 61.28,22.92 v64.17,20.03
  Bottom 0.508: R22.2 90.46,57.79 83.66,50.99 83.66,28.96 74.74,20.03 v64.17,20.03
GND  (via drill 0.38)
  Top 0.508: 27.09,67.94 C19.2 27.14,67.94 v28.7,67.94 v25.53,67.94 | 57.62,67.94 C25.2 57.57,67.94 v56.01,67.94 v59.18,67.94 | 88.05,67.94 C22.2 88.1,67.94 v89.66,67.94 v86.49,67.94
  Bottom 0.305: SH2.2 R13.1 | SH1.2 R18.1
  other vias: 61.09,45.43 61.09,42.86 52.45,45.43 52.45,42.86 43.05,45.4 36.67,44.89 42.67,18.35 52.51,16.35 53.78,13.81 65.94,45.4 65.94,42.86 50.58,36.64 105.76,42.55 105.76,48.9 52.45,35.24 6.35,51.94 32.26,44.13 6.29,57.44 2.48,70.61 89.09,27.69 89.09,32.26 89.09,36.83 53.02,30.73 52.01,30.73 50.99,30.73 54.04,30.73 55.05,30.73 53.02,22.61 52.01,22.61 54.04,22.61 55.05,22.61 50.99,22.61 31.69,9.72 36.64,40.01 36.64,37.47 52.45,37.78 36.64,41.28 67.56,36.35 67.56,37.18 67.56,35.53 40.89,20 63.75,36.35 56.83,41.59 47.62,45.43 47.62,42.89 32.19,32.23 72.8,43.88 72.8,42.99 90.36,12.22 97.98,12.99 95.69,25.18 88.96,15.91 33.08,32.23 32.19,31.34 61.98,37.78 60.45,36.13 33.27,51.5 33.08,31.34
  pour Top (rank 3): -18.1,104.14 139.38,104.14 139.38,-15.24 -18.1,-15.24
  pour Bottom (rank 2): -26.99,99.57 140.65,99.57 140.65,-26.67 -26.99,-26.67
  pour Bottom (no thermals): 99.89,61.44 99.89,58.9 100.68,58.1 101.89,58.1 102.68,58.9 102.68,61.44 101.89,62.23 100.68,62.23
  pour Bottom (no thermals): 48.32,66.29 52.77,66.29 52.77,63.5 48.32,63.5
  pour Bottom (no thermals): 78.9,67.56 83.38,67.56 83.38,63.75 78.9,63.75
  pour UpperMid (rank 2): -22.67,101.6 144.46,101.6 144.46,-18.29 -22.67,-18.29
HALL_A  (via drill 0.38)
  Top 0.305: v70.96,51.91 71.75,51.12 84.77,51.12 v84.93,50.96 88.11,47.78 88.11,40.75 C41.1 89.23,39.62 R41.1
  LowerMid 0.305: v70.96,51.91 69.53,53.34 50.48,53.34 U$2.PA5 | v84.93,50.96 89.85,55.88 U$22.P$1
HALL_B  (via drill 0.38)
  Top 0.305: v69.69,51.91 71.12,50.48 84.07,50.48 v85.79,48.77 87.57,46.99 87.57,36.71 C42.1 89.23,35.05 R40.1
  LowerMid 0.305: v69.69,51.91 68.9,52.71 54.93,52.71 U$2.PE5 | v85.79,48.77 85.79,50.8 89.6,54.61 92.77,54.61 U$21.P$1
HALL_C  (via drill 0.38)
  Top 0.305: v68.42,51.91 70.49,49.85 83.44,49.85 v86.55,46.74 86.99,46.29 86.99,32.71 C43.1 89.23,30.48 R39.1
  LowerMid 0.305: U$2.PB5 64.45,52.07 68.26,52.07 v68.42,51.91 | U$23.P$1 95.57,53.98 89.98,53.98 86.55,50.55 v86.55,46.74
INH_A  (via drill 0.38)
  Top 0.305: U$1.17 37.13,25.42 v35.88,26.67
  LowerMid 0.305: U$2.PF2 61.28,12.06 40.39,12.06 39.37,13.08 39.37,23.18 v35.88,26.67
INH_B  (via drill 0.38)
  Top 0.305: U$1.19 36.17,24.42 v35.88,24.13
  LowerMid 0.305: U$2.PB3 57.47,10.79 39.75,10.79 38.1,12.45 38.1,21.91 v35.88,24.13
INH_C  (via drill 0.38)
  Top 0.305: U$1.21 37.71,23.42 v35.88,21.59
  LowerMid 0.305: U$2.PC5 53.66,9.53 39.12,9.53 36.83,11.81 36.83,20.64 v35.88,21.59
INL_A  (via drill 0.38)
  Top 0.305: U$1.18 36.36,24.92 v35.88,25.4
  LowerMid 0.305: U$2.PF3 59.37,11.43 40.07,11.43 38.74,12.76 38.74,22.54 v35.88,25.4
INL_B  (via drill 0.38)
  Top 0.305: U$1.20 36.94,23.92 v35.88,22.86
  LowerMid 0.305: U$2.PC4 55.56,10.16 39.43,10.16 37.46,12.13 37.46,21.27 v35.88,22.86
INL_C  (via drill 0.38)
  Top 0.305: U$1.22 38.48,22.92 v35.88,20.32
  LowerMid 0.305: U$2.PC6 51.75,8.89 38.8,8.89 35.88,11.81 v35.88,20.32
N$1
  Top 0.305: U$1.2 48.36,32.92 41.28,40.01 C2.2 R2.1
N$2
  Top 0.305: C1.1 37.44,43.06 R2.2
N$3
  Top 0.305: U$1.3 47.91,32.42 42.86,37.47 R4.2 39.76,37.84 38.86,38.74 R3.1
N$4
  Top 0.305: U$1.1 48.82,33.42 R1.2
N$5
  Top 0.305: U$1.7 46.04,30.42 44.33,32.13 R8.1
N$6
  Top 0.305: U$1.14 40.34,26.92 C4.1
N$7
  Top 0.305: U$1.15 39.04,26.42 C4.2
N$8
  Top 0.305: U$1.13 41.48,27.42 39.56,29.34 C3.1
N$9
  Top 0.305: U$1.23 43.83,22.42 C5.1
N$10  (via drill 0.38)
  Top 0.305: U$1.25 45.9,21.42 v45.56,21.08 | v47.91,38.23 45.97,40.16 R9.1
  LowerMid 0.305: v45.56,21.08 45.56,27.53 47.91,29.88 v47.91,38.23
N$11  (via drill 0.38)
  Top 0.305: U$1.26 46.67,20.92 v45.56,19.81 | v47.02,37.47 43.79,40.69 R10.1
  LowerMid 0.305: v45.56,19.81 44.61,20.76 44.61,27.53 47.02,29.94 v47.02,37.47
N$12
  Top 0.305: U$1.27 47.67,20.42 C8.1
N$13
  Bottom 0.305: U$12.P$1 26.98,56.52 D13.C 25.07,57.66 R11.1
  Bottom 0.508: R11.1 25.02,59.6 Q1.1
N$14  (via drill 0.38)
  Top 0.305: U$16.P$1 49.47,57.15 54.55,57.15 v54.8,57.4
  Bottom 0.305: D11.C 58.58,57.66 Q3.1 | v54.8,57.4 55.46,57.4 R16.1
  Bottom 0.508: R16.1 55.84,59.93 Q3.1
N$15
  Bottom 0.508: Q4.1 72.68,58.17 73.72,58.17 D10.C 76,55.88 U$17.P$1 78.66,55.88 R17.1
N$16
  Bottom 0.305: U$15.P$1 38.1,57.72 40.2,57.72 | D12.C 41.49,55.03 R12.1
  Bottom 0.508: R12.1 40.2,56.06 40.2,57.72 Q2.1
N$17
  Bottom 0.406: D14.C 85.79,57.27 85.79,57.4
  Bottom 0.508: R21.1 83.61,55.22 U$18.P$1 85.79,57.4 86.55,58.17 Q5.1
N$18
  Bottom 0.406: U$19.P$1 106.37,65.54 D15.C Q6.1
  Bottom 0.508: R22.1 104.97,57.79 106.36,59.18 Q6.1
N$20
  Top 0.305: R39.2 93.04,29.21 | 93.04,29.21 R37.2 | U$8.2 93.04,29.21
N$21
  Top 0.305: U$1.38 63.56,24.42 65.04,22.93 C11.1
N$22
  Top 0.305: C30.2 32.14,47.09 R23.1
N$23
  Top 0.305: D6.C 2.79,58.1 R32.1
N$24
  Top 0.305: D7.C 2.79,52.54 R33.1
N$25
  Top 0.305: U$1.43 69.55,26.92 C12.1
N$26
  Top 0.305: D8.C 109.29,43.15 R34.1
N$27
  Top 0.305: D9.C 109.29,49.5 R35.1
N$28
  Top 0.305: D9.A Q8.3
N$29
  Top 0.305: U$1.48 62.63,29.42 65.72,32.51 66.75,32.51 C13.1
N$30
  Top 0.305: U$1.52 58.9,31.42 C14.1
N$31
  Top 0.305: U$1.51 U$1.50 56.51,30.67
  Top 0.406: C14.2 61.47,31.94 61.47,31.93
  Top 0.508: 69.8,36.08 D1.C
  Top 0.813: 56.51,30.67 60.21,30.67 61.47,31.93 63.32,33.78 67.5,33.78 69.8,36.08 | D1.C 71.75,38.06 U$14.P$1
N$32
  Top 0.305: D8.A Q7.3
N$33
  Top 0.305: R40.2 R36.2 94.05,31.75 U$8.3
N$34
  Top 0.305: U$4.1 8.57,34.29 7.81,33.53 7.81,10.54 11.75,6.6 29.77,6.6 R31.2
N$35
  Top 0.305: U$1.56 55.32,34.87 C16.1
N$38
  Top 0.305: R51.1 4.76,67.68 | 4.76,67.68 R50.2 | Q9.1 4.76,64.97 | 4.76,64.97 4.76,67.68 | 4.76,64.97 2.66,64.97 D16.C
N$39
  Top 0.305: R41.2 R38.2 96.09,34.29 U$8.4
N$40
  Top 0.305: C44.1 95.32,14.61 U2.1
N$41
  Top 0.305: D6.A 4.78,61.27 Q9.2 2.68,63.06 D16.A
N$42
  Top 0.305: C44.2 95.32,17.14 U2.3
N$43
  Top 0.305: C45.1 95.45,18.41 U2.4
N$44
  Top 0.305: C45.2 94.92,19.68 U2.5
N$45
  Top 0.305: U2.6 94.44,20.95 C48.1
N$46
  Top 0.305: U2.2 92.82,15.89 C47.1
NFAULT  (via drill 0.38)
  Top 0.305: U$1.6 46.55,30.92 43.82,33.66 v43.37,33.66 R7.1 | Q7.1 91.06,46.04 85.28,51.82 72.58,51.82 71.06,53.34 47.94,53.34 U$2.PA6
  LowerMid 0.305: v43.37,33.66 44.13,34.42 44.13,49.53 U$2.PA6
NOCTW  (via drill 0.38)
  Top 0.305: U$1.5 47,31.42 43.5,34.93 v41.56,34.93 R6.1 | Q8.1 73.03,52.39 71.44,53.98 46.04,53.98 U$2.PA7
  LowerMid 0.305: v41.56,34.93 41.56,49.5 U$2.PA7
NSCS  (via drill 0.38)
  Top 0.305: U$1.8 45.33,29.92 v45.02,30.23
  LowerMid 0.305: U$2.PB2 60.01,1.91 41.02,1.91 32.23,10.7 32.23,28.54 36.13,32.45 42.8,32.45 v45.02,30.23
PVDD  (via drill 0.61)
  Top 0.305: R50.1 5.13,69.6 9.59,69.6 | R26.1 64.78,39.16 58.42,32.8 58.09,32.53 | U$1.53 U$1.54 56.52,32.16 56.48,32.16
  Top 0.813: 56.48,32.16 57.78,32.16 58.42,32.8 58.42,33.97 57.65,34.74 | v56.77,34.74 57.65,34.74 | C18.2 55.45,37.72 C17.1 57.65,37.72 57.65,34.74 | v56.77,18.89 56.84,18.89 C10.1 56.78,16.38 C9.1
  pour Top (isolate 0.305, no thermals): 30.64,56.48 29.11,58.01 29.11,63.37 31.78,66.04 46.83,66.04 50.64,62.23 50.64,58.32 51.18,57.79 59.12,57.79 59.59,58.26 59.59,63.37 62.26,66.04 77.31,66.04 81.12,62.23 81.12,58.26 81.6,57.79 89.6,57.79 90.07,58.26 90.07,63.21 92.74,65.88 92.74,76.2 90.2,78.74 16.19,78.74 8.83,71.37 8.83,10.92 12.13,7.62 27.08,7.62 30.64,11.18
  pour Top (no thermals): 56.07,19.94 56.07,18.54 56.58,18.03 56.96,18.03 57.47,18.54 57.47,19.94
  pour LowerMid (rank 2): -29.78,105.66 147.76,105.66 147.76,-22.61 -29.78,-22.61
PVDDSENSE
  Top 0.305: R26.2 R27.1 C31.1 | C31.1 63.24,45.67 | C31.1 62.98,45.92 U$2.PD0
  Bottom 0.305: U1.3 58.81,43.64 59.88,44.7 59.88,47.5 U$2.PD0
PWM_IN
  Top 0.305: R31.1 C40.1 38.53,5.08 U$2.PA2
PWRGD
  Top 0.305: U$1.4 47.46,31.92 43.18,36.2 R5.1
SCLK  (via drill 0.38)
  Top 0.305: U$1.11 43.02,28.42 v41.21,30.23
  LowerMid 0.305: v41.21,30.23 42.16,29.27 45.4,29.27 46.07,29.94 46.07,39.81 49.21,42.96 49.21,49.53 U$2.PB4
SDI  (via drill 0.38)
  Top 0.305: U$1.9 44.56,29.42 v43.75,30.23
  LowerMid 0.305: U$2.PB7 50.48,2.54 41.34,2.54 32.86,11.02 32.86,28.23 36.45,31.81 42.16,31.81 v43.75,30.23
SDO  (via drill 0.38)
  Top 0.305: U$1.10 43.79,28.92 v42.48,30.23
  LowerMid 0.305: U$2.PB6 48.58,3.17 41.66,3.17 33.5,11.33 33.5,27.91 36.77,31.18 41.53,31.18 v42.48,30.23
SH_A  (via drill 0.38)
  Top 0.305: U$1.46 65.35,28.42 v65.98,29.05 66.8,29.88 C13.2 | 59.88,39.88 59.96,39.95 R14.1 59.12,39.49 v59.12,35.05 | U$25.P$1 31.94,58.42
  LowerMid 0.305: v59.12,35.05 59.12,34.04 64.1,29.05 v65.98,29.05
  Bottom 0.305: v65.98,29.05 72.23,29.05 76.36,33.18 76.36,50.17 71.91,54.61 45.4,54.61 44.13,55.88 44.13,57.79 42.74,59.18 Q2.2 | Q1.3 30.67,59.05 D13.A
  pour Top (isolate 0.305, rank 2, no thermals): 32.1,65.41 29.72,63.02 29.72,58.26 30.19,57.79 49.28,57.79 49.82,58.32 49.82,62.07 46.48,65.41
  pour UpperMid (isolate 0.305, no thermals): 32.1,65.41 29.72,63.02 29.72,58.26 30.19,57.79 49.28,57.79 49.82,58.32 49.82,62.07 46.48,65.41
SH_B  (via drill 0.38)
  Top 0.305: U$1.41 66.37,25.92 68.1,24.18 C12.2 71.97,24.18 v73.65,25.86 73.65,29.41 v70.29,32.77 | 53.53,40.27 R19.1 53.52,40.26 v52.51,40.26 | U$24.P$1 58.36,55.88 60.9,58.42
  LowerMid 0.305: v70.29,32.77 62.67,32.77 55.18,40.26 v52.51,40.26
  Bottom 0.305: v73.65,25.86 79.06,31.27 79.06,51.59 73.18,57.47 62.43,57.47 D11.A 62.24,59.08 Q3.3
  pour Top (isolate 0.305, rank 2, no thermals): 62.58,65.41 60.2,63.02 60.2,58.26 60.67,57.79 79.76,57.79 80.3,58.32 80.3,62.07 76.96,65.41
  pour UpperMid (isolate 0.305, no thermals): 62.58,65.41 60.2,63.02 60.2,58.26 60.67,57.79 79.76,57.79 80.3,58.32 80.3,62.07 76.96,65.41
SH_C  (via drill 0.38)
  Top 0.305: U$1.36 62.07,23.42 v64.17,21.32 65.98,21.32 C11.2 | v48.83,39.12 48.83,40.25 R24.1 | U$20.P$1 104.08,65.02
  LowerMid 0.305: v64.17,21.32 64.17,21.3 61.51,18.65 61.51,17.63 60.9,17.02 59.63,17.02 58.1,18.54 58.1,36.32 55.31,39.12 v48.83,39.12
  Bottom 0.305: v64.17,21.32 74.82,21.32 82.87,29.37 82.87,51.3 88.46,56.89 | 88.46,56.89 91.63,60.06 Q5.3 | D14.A 88.46,56.89
  pour Top (isolate 0.305, rank 2, no thermals): 93.06,65.41 90.68,63.02 90.68,58.26 91.15,57.79 109.98,57.79 110.52,58.32 110.52,62.07 107.19,65.41
  pour UpperMid (isolate 0.305, no thermals): 93.06,65.41 90.68,63.02 90.68,58.26 91.15,57.79 109.98,57.79 110.52,58.32 110.52,62.07 107.19,65.41
SL_A  (via drill 0.38)
  Top 0.305: 59.33,27.42 U$1.44 70.7,27.42 v71.37,28.1 | U$1.33 60.08,21.92 v60.26,21.72
  LowerMid 0.305: v60.26,21.72 66.64,28.1 v71.37,28.1
  Bottom 0.305: v71.37,28.1 72.23,28.1 76.99,32.86 76.99,50.48 72.23,55.25 54.9,55.25 50.99,59.15 51.75,59.44 | D12.A 45.32,57.83 45.4,57.91
  pour Bottom (isolate 0.305, no thermals): 44.13,61.75 44.13,58.9 45.24,57.79 51.66,57.79 52.77,58.9 52.77,61.75 51.82,62.71 45.08,62.71
SL_B  (via drill 0.38)
  Top 0.305: U$1.39 64.23,24.92 v64.71,24.45 | U$1.31 58.55,20.92 v60.26,19.21
  LowerMid 0.305: v64.71,24.45 63.98,24.45 61.47,21.94 61.47,20.41 v60.26,19.21
  Bottom 0.305: 80.96,58.42 80.64,58.1 80.64,30.32 74.3,23.97 65.18,23.97 v64.71,24.45
  pour Bottom (isolate 0.305, no thermals): 74.61,61.75 74.61,58.9 75.72,57.79 82.14,57.79 83.25,58.9 83.25,61.75 82.3,62.71 75.56,62.71
SO1
  Top 0.305: U$2.PE1 49.21,46.99 47.57,46.99 C6.1 R9.2
SO2
  Top 0.305: U$2.PE2 46.67,46.99 41.73,46.99 C7.1 42.04,42.49 R10.2
SP1  (via drill 0.38)
  Top 0.305: U$1.32 59.32,21.42 v60.26,20.48
  Bottom 0.305: v60.26,20.48 62.04,22.26 62.04,23.18 66.01,27.15 72.23,27.15 77.63,32.54 77.63,50.8 72.55,55.88 55.31,55.88 53.59,57.6 53.59,62.42 52.58,63.44 SH2.1
SP2  (via drill 0.38)
  Top 0.305: U$1.30 57.78,20.42 v60.26,17.94
  Bottom 0.305: v60.26,17.94 62.93,20.61 62.93,22.64 63.63,23.34 74.61,23.34 81.28,30 81.28,55.82 84.07,58.61 84.07,62.42 83.06,63.44 SH1.1
UART_RX  (via drill 0.38)
  Top 0.305: U$2.PB0 61.91,52.07 66.23,52.07 69.79,48.51 81.72,48.51 v84.52,45.72 | v84.52,42.93 84.52,21.84 86.68,19.68 U2.12
  LowerMid 0.305: v84.52,45.72 v84.52,42.93
UART_TX  (via drill 0.38)
  Top 0.305: U$2.PB1 60.01,52.71 66.61,52.71 70.17,49.15 82.61,49.15 v85.41,46.36 | v85.41,42.16 85.41,22.22 86.68,20.95 U2.11
  LowerMid 0.305: v85.41,46.36 v85.41,42.16
VCC  (via drill 0.38)
  Top 0.305: R3.2 R5.2 33.71,34.93 | 33.71,34.93 R7.2 | R6.2 33.71,34.93 | U$1.49 61.64,29.92 v63.15,31.43 | 7.81,54.86 7.81,63.08 Q9.3 U$10.P$1 | 7.81,54.86 v7.81,40.39 | 91.24,28.31 R37.1 92.14,28.19 | 92.14,26.67 92.14,28.19 | 92.14,28.19 92.14,32.77 | 92.14,32.77 92.14,36.44 R38.1 | R36.1 92.14,32.77 | D7.A 7.75,54.93 7.81,54.86 | R3.2 33.71,44.22 39.02,49.53 64.45,49.53 U$2.+3V3 | C32.2 77.63,46.4 77.66,46.43 | C46.1 87.41,12.21 U2.16 88.96,14.61 90.11,15.75 90.11,26.67 | R3.2 v32.7,38.74 | U$1.24 44.97,21.92 42.1,19.05 33.72,19.05 31.43,21.34 31.43,33.27 33.08,34.93 33.71,34.93
  Top 0.508: 101.5,44.2 101.5,49.42 Q8.2 | 101.5,44.2 101.5,26.67 | 101.5,26.67 U$8.1 92.14,26.67 90.11,26.67 88.07,26.67 86.3,28.45 86.3,42.67 82.53,46.43 80.59,46.43 | U$14.P$2 77.66,46.43 80.59,46.43 | 80.59,46.43 C33.2 | C36.1 103.79,24.38 101.5,26.67 | Q7.2 101.44,44.14 101.5,44.2
  Top 0.813: U$14.P$2 70.09,46.43 U$2.+3V3
  LowerMid 0.305: v63.15,31.43 70.49,31.43 71.31,32.26 71.31,45.21 U$2.+3V3 | v32.7,38.74 9.46,38.74 v7.81,40.39
  Bottom 0.305: U1.5 56.2,44.58 56.83,45.21 56.83,49.02 57.34,49.53 64.45,49.53 U$2.+3V3

### Text on the board
tPlace: A | B | C | GND | VDD | C | GL_C | VCC | VDD | VCC | GH_A | A | GL_A | GH_B | B | GL_B | GH_C | H_C | H_B | H_A | GND | + | OCTW | FAULT | Hall Effect / Vcc C B A GND | Drive Board / PWM NC GND RX TX | GND | Missouri S&T / Mars Rover Design Team / Brushless DC Motor Controller / Rev. 2, 2017 / Cameron Nichols | GND